# Altium schematic sheet ProtectionChannelB.SchDoc
size 420 x 297 mm; Address1: Address1; Address2: Address2; Address3: Address3; Address4: Address4; DocumentNumber: АБВГ.123456.001 Э3; SheetNumber: 3; SheetTotal: 7; Scale: 1:1; DocumentType: Схема электрическая принципиальная; FirstReferrence: АБВГ.123456.001
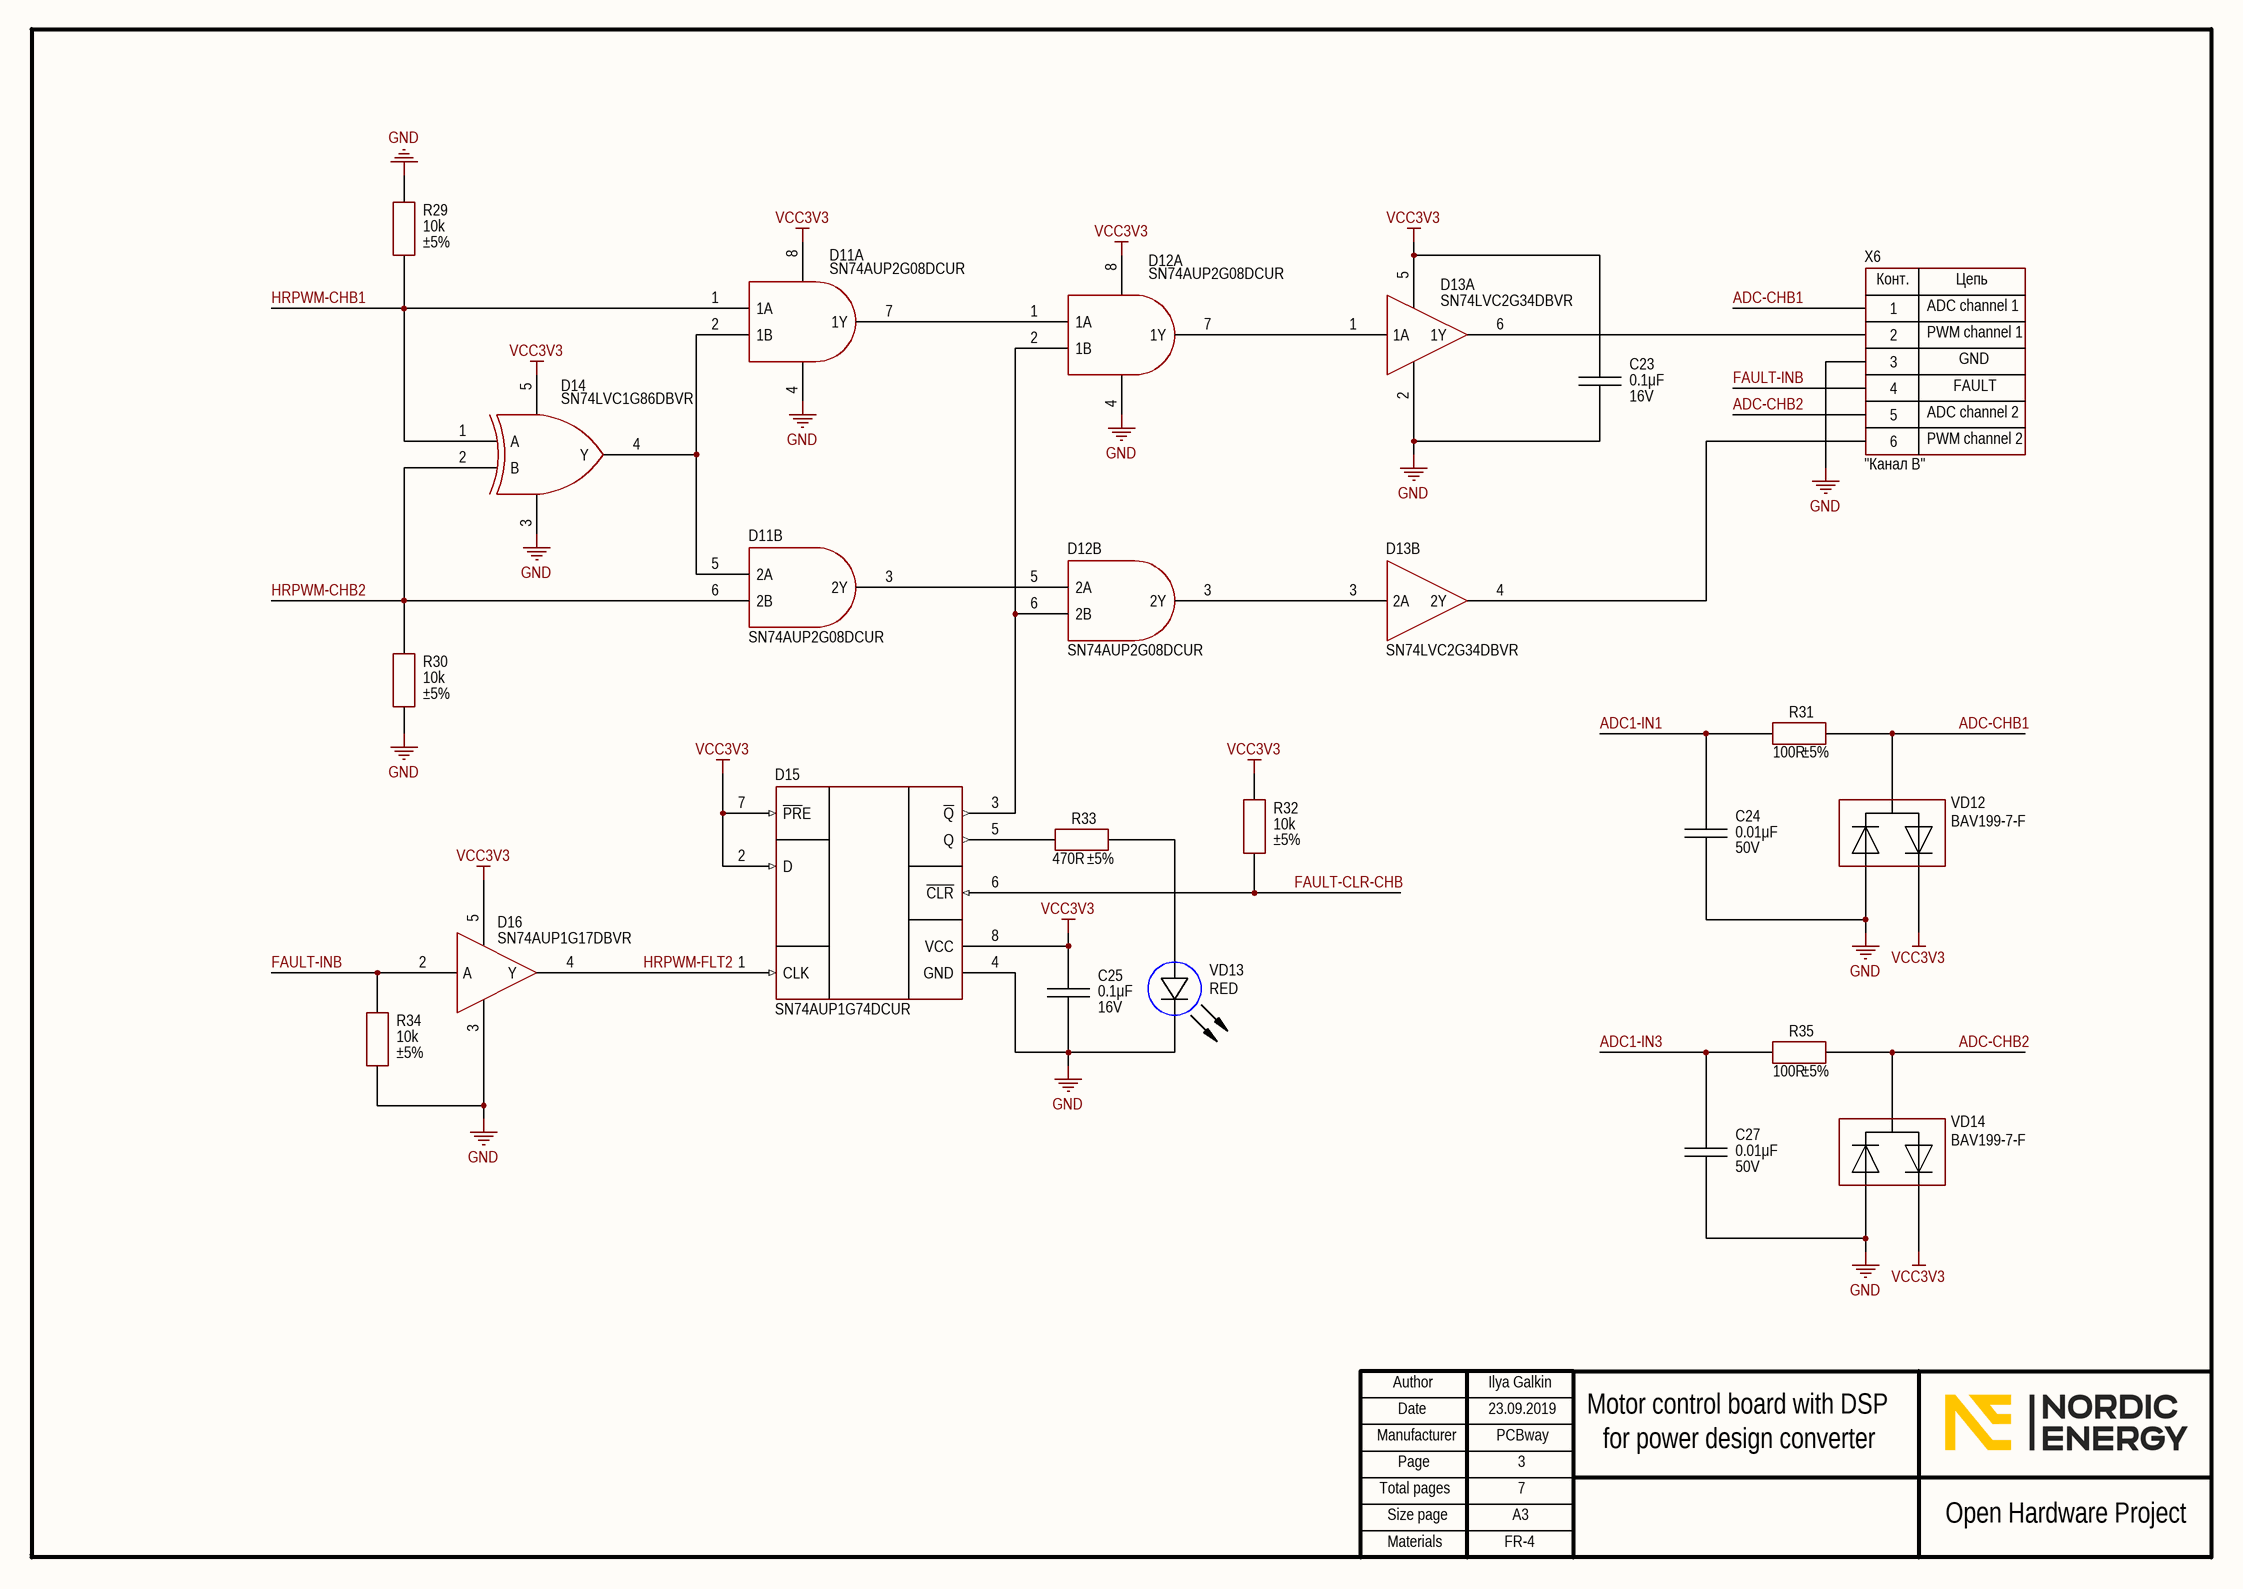
[diagram p0: ProtectionChannelB.SchDoc]

## Parts
C23  value 0.1μF  Voltage: 16V  [CAP: 0805]
C24  value 0.01μF  Voltage: 50V  [CAP: 0805]
C25  value 0.1μF  Voltage: 16V  [CAP: 0805]
C27  value 0.01μF  Voltage: 50V  [CAP: 0805]
D11  (no value)  [8-VSSOP]  (parts A,B of 2)
D12  (no value)  [8-VSSOP]  (parts A,B of 2)
D13  (no value)  [SOT23-6]  (parts A,B of 2)
D14  (no value)  [SOT23-5]
D15  (no value)  [8-VSSOP]
D16  (no value)  [SOT23-5]
R29  value 10k  Tolerance: ±5%  [RES: 0805]
R30  value 10k  Tolerance: ±5%  [RES: 0805]
R31  value 100R  Tolerance: ±5%  [RES: 0805]
R32  value 10k  Tolerance: ±5%  [RES: 0805]
R33  value 470R  Tolerance: ±5%  [RES: 0805]
R34  value 10k  Tolerance: ±5%  [RES: 0805]
R35  value 100R  Tolerance: ±5%  [RES: 0805]
VD12  PartNumber: BAV199-7-F  [SOT23]
VD13  Color: RED  [LED: 0805R]
VD14  PartNumber: BAV199-7-F  [SOT23]
X6  CommentText: "Канал B"  [CON: PLD-6]

## Nets
GND: C23.1 C24.1 C25.1 C27.1 D11.4 D12.4 D13.2 D14.3 D15.4(GND) D16.3 R29.1 R30.2 R34.2 VD12.1 VD13.2(C) VD14.1 X6.3
VCC3V3: C23.2 C25.2 D11.8 D12.8 D13.5 D14.5 D15.2(D) D15.7(~{PR}E) D15.8(VCC) D16.5 R32.1 VD12.2 VD14.2
ADC1-IN1: C24.2 R31.1
ADC1-IN3: C27.2 R35.1
ADC-CHB1: R31.2 VD12.3 X6.1
ADC-CHB2: R35.2 VD14.3 X6.5
FAULT-CLR-CHB: D15.6(~{CLR}) R32.2
FAULT-INB: D16.2(A) R34.1 X6.4
HRPWM-CHB1: D11.1(1A) D14.1(A) R29.2
HRPWM-CHB2: D11.6(2B) D14.2(B) R30.1
HRPWM-FLT2: D15.1(CLK) D16.4(Y)
NetD11_2: D11.2(1B) D11.5(2A) D14.4(Y)
NetD11_3: D11.3(2Y) D12.5(2A)
NetD11_7: D11.7(1Y) D12.1(1A)
NetD12_2: D12.2(1B) D12.6(2B) D15.3(~{Q})
NetD12_3: D12.3(2Y) D13.3(2A)
NetD12_7: D12.7(1Y) D13.1(1A)
NetD13_4: D13.4(2Y) X6.6
NetD13_6: D13.6(1Y) X6.2
NetD15_5: D15.5(Q) R33.2
NetR33_1: R33.1 VD13.1(A)

## Notes on the sheet
- ADC channel 1
- PWM channel 1
- FAULT
- GND
- ADC channel 2
- PWM channel 2
- Ilya Galkin
- 23.09.2019
- PCBway
- 3
- Motor control board with DSP
- for power design converter
- 7
- FR-4
- Author
- Manufacturer
- Date
- Page
- Total pages
- Size page
- A3
- Open Hardware Project
- Materials
- (in symbol PLD-6) Конт.; Цепь

## Library data of the parts
C23 C25 = Ceramic_0805: Manufacturer: Yageo; PartNumber: CC0805KRX7R7BB104; ValueManufacturerPartNumber: Ceramic capacitor, 0.1μF, X7R, ±10%, 16V, 0805, -55...+125°C; TypeCapacitor: Ceramic capacitor; Tolerance: ±10%; TypeDielectric: X7R; Package: 0805; HelpURL: https://www.digikey.com/product-detail/en/yageo/CC0805KRX7R7BB104/311-1142-1-ND/303052; Temperature: -55...+125°C
C24 C27 = Ceramic_0805: Manufacturer: Yageo; PartNumber: CC0805KRX7R9BB103; ValueManufacturerPartNumber: Ceramic capacitor, 0.01μF, X7R, ±10%, 50V, 0805, -55...+125°C; TypeCapacitor: Ceramic capacitor; Tolerance: ±10%; TypeDielectric: X7R; Package: 0805; HelpURL: https://www.digikey.com/product-detail/en/yageo/CC0805KRX7R9BB103/311-1136-1-ND/303046; Temperature: -55...+125°C
D11 D12 = SN74AUP2G08DCUR: AND; Manufacturer: Texas Instruments; ValueManufacturerPartNumber: IC logic AND, 0.8...3.6V, -40...+855°C, 8-VSSOP; Supply: 0.8...3.6V; HelpURL: https://www.digikey.com/product-detail/en/texas-instruments/SN74AUP2G08DCUR/296-32271-1-ND/3505517; Package: 8-VSSOP; ComponentType: IC logic AND; Temperature: -40...+855°C; PartNumber: SN74AUP2G08DCUR
D13 = SN74LVC2G34DBVR: Buffer; Manufacturer: Texas Instruments; ValueManufacturerPartNumber: IC logic buffer, 1.65...5.5V, -40...+125°C, SOT23-6; Supply: 1.65...5.5V; HelpURL: https://www.digikey.com/product-detail/en/texas-instruments/SN74LVC2G34DBVR/296-13496-1-ND/486431; Package: SOT23-6; ComponentType: IC logic buffer; Temperature: -40...+125°C; PartNumber: SN74LVC2G34DBVR
D14 = SN74LVC1G86DBVR: XOR; Manufacturer: Texas Instruments; ValueManufacturerPartNumber: IC logic XOR, 1.65...5.5V, -40...+125°C, SOT23-5; Supply: 1.65...5.5V; HelpURL: https://www.digikey.com/product-detail/en/texas-instruments/SN74LVC1G86DBVR/296-9853-1-ND/380077; Package: SOT23-5; ComponentType: IC logic XOR; Temperature: -40...+125°C; PartNumber: SN74LVC1G86DBVR
D15 = SN74AUP1G74DCUR: D-trigger; Manufacturer: Texas Instruments; ValueManufacturerPartNumber: ICtrigger D-type, 0.8...3.6V, -40...+85°C, 8-VSSOP; Supply: 0.8...3.6V; HelpURL: https://www.digikey.com/product-detail/en/texas-instruments/SN74AUP1G74DCUR/296-19761-1-ND/1091423; Package: 8-VSSOP; ComponentType: ICtrigger D-type; Temperature: -40...+85°C; PartNumber: SN74AUP1G74DCUR
D16 = SN74AUP1G17DBVR: Schmitt trigger; Manufacturer: Texas Instruments; ValueManufacturerPartNumber: IC Schmitt trigger, 0.8...3.6V, -40...+85°C, SOT23-6; Supply: 0.8...3.6V; HelpURL: https://www.digikey.com/product-detail/en/texas-instruments/SN74AUP1G17DBVR/296-19077-1-ND/864308; Package: SOT23-6; ComponentType: IC Schmitt trigger; Temperature: -40...+85°C; PartNumber: SN74AUP1G17DBVR
R29 R30 R32 R34 = Resistor_0805: Manufacturer: Yageo; PartNumber: RC0805JR-0710KL; ValueManufacturerPartNumber: Resistor film, 10k, ±5%, 0805, 0.125W, -55...+125°C; TypeResistor: Resistor film; Power: 0.125W; Package: 0805; HelpURL: https://www.digikey.com/product-detail/en/yageo/RC0805JR-0710KL/311-10KARCT-ND/731188; Temperature: -55...+125°C
R31 R35 = Resistor_0805: Manufacturer: Yageo; PartNumber: RC0805JR-07100RL; ValueManufacturerPartNumber: Resistor film, 100R, ±5%, 0805, 0.125W, -55...+125°C; TypeResistor: Resistor film; Power: 0.125W; Package: 0805; HelpURL: https://www.digikey.com/product-detail/en/yageo/RC0805JR-07100RL/311-100ARCT-ND/731185; Temperature: -55...+125°C
R33 = Resistor_0805: Manufacturer: Yageo; PartNumber: RC0805JR-07470RL; ValueManufacturerPartNumber: Resistor film, 470R, ±5%, 0805, 0.125W, -55...+125°C; TypeResistor: Resistor film; Power: 0.125W; Package: 0805; HelpURL: https://www.digikey.com/product-detail/en/yageo/RC0805JR-07470RL/311-470ARCT-ND/731280; Temperature: -55...+125°C
VD12 VD14 = Diode_array: Manufacturer: Diodes Incorporated; ValueManufacturerPartNumber: Diode array, 85V, 140mA, 1.1V, 3us, SOT-23, -65...+150°C; TypeDiode: Diode array; Voltage: 85V; Current: 140mA; VoltageDrop: 1.1V; RecoveryTime: 3us; Package: SOT-23; HelpURL: https://www.digikey.com/product-detail/en/diodes-incorporated/BAV199-7-F/BAV199-FDICT-ND/1033647; Temperature: -65...+150°C
VD13 = LED_single: Manufacturer: Wurth; ValueManufacturerPartNumber: LED, 20mA, 2V, 0805, -55...+150°C; PartNumber: 150080RS75000; TypeDiode: LED; Current: 20mA; VoltageDrop: 2V; Package: 0805; HelpURL: https://www.digikey.com/product-detail/en/wurth-electronics-inc/150080RS75000/732-4984-1-ND/4489916; Temperature: -55...+150°C
X6 = PLD-6: Manufacturer: Connfly; ValueManufacturerPartNumber: Connector, 6pin, 2.54mm, 500VAC, 3A; TypeConnector: Connector; VoltageMax: 500VAC; Pitch: 2.54mm; CurrentMax: 3A; Multichannel: 6pin; HelpURL: https://www.chipdip.ru/product/pld-6; PartNumber: PLD-6